# EAGLE design main_board (EAGLE 9.6.2)
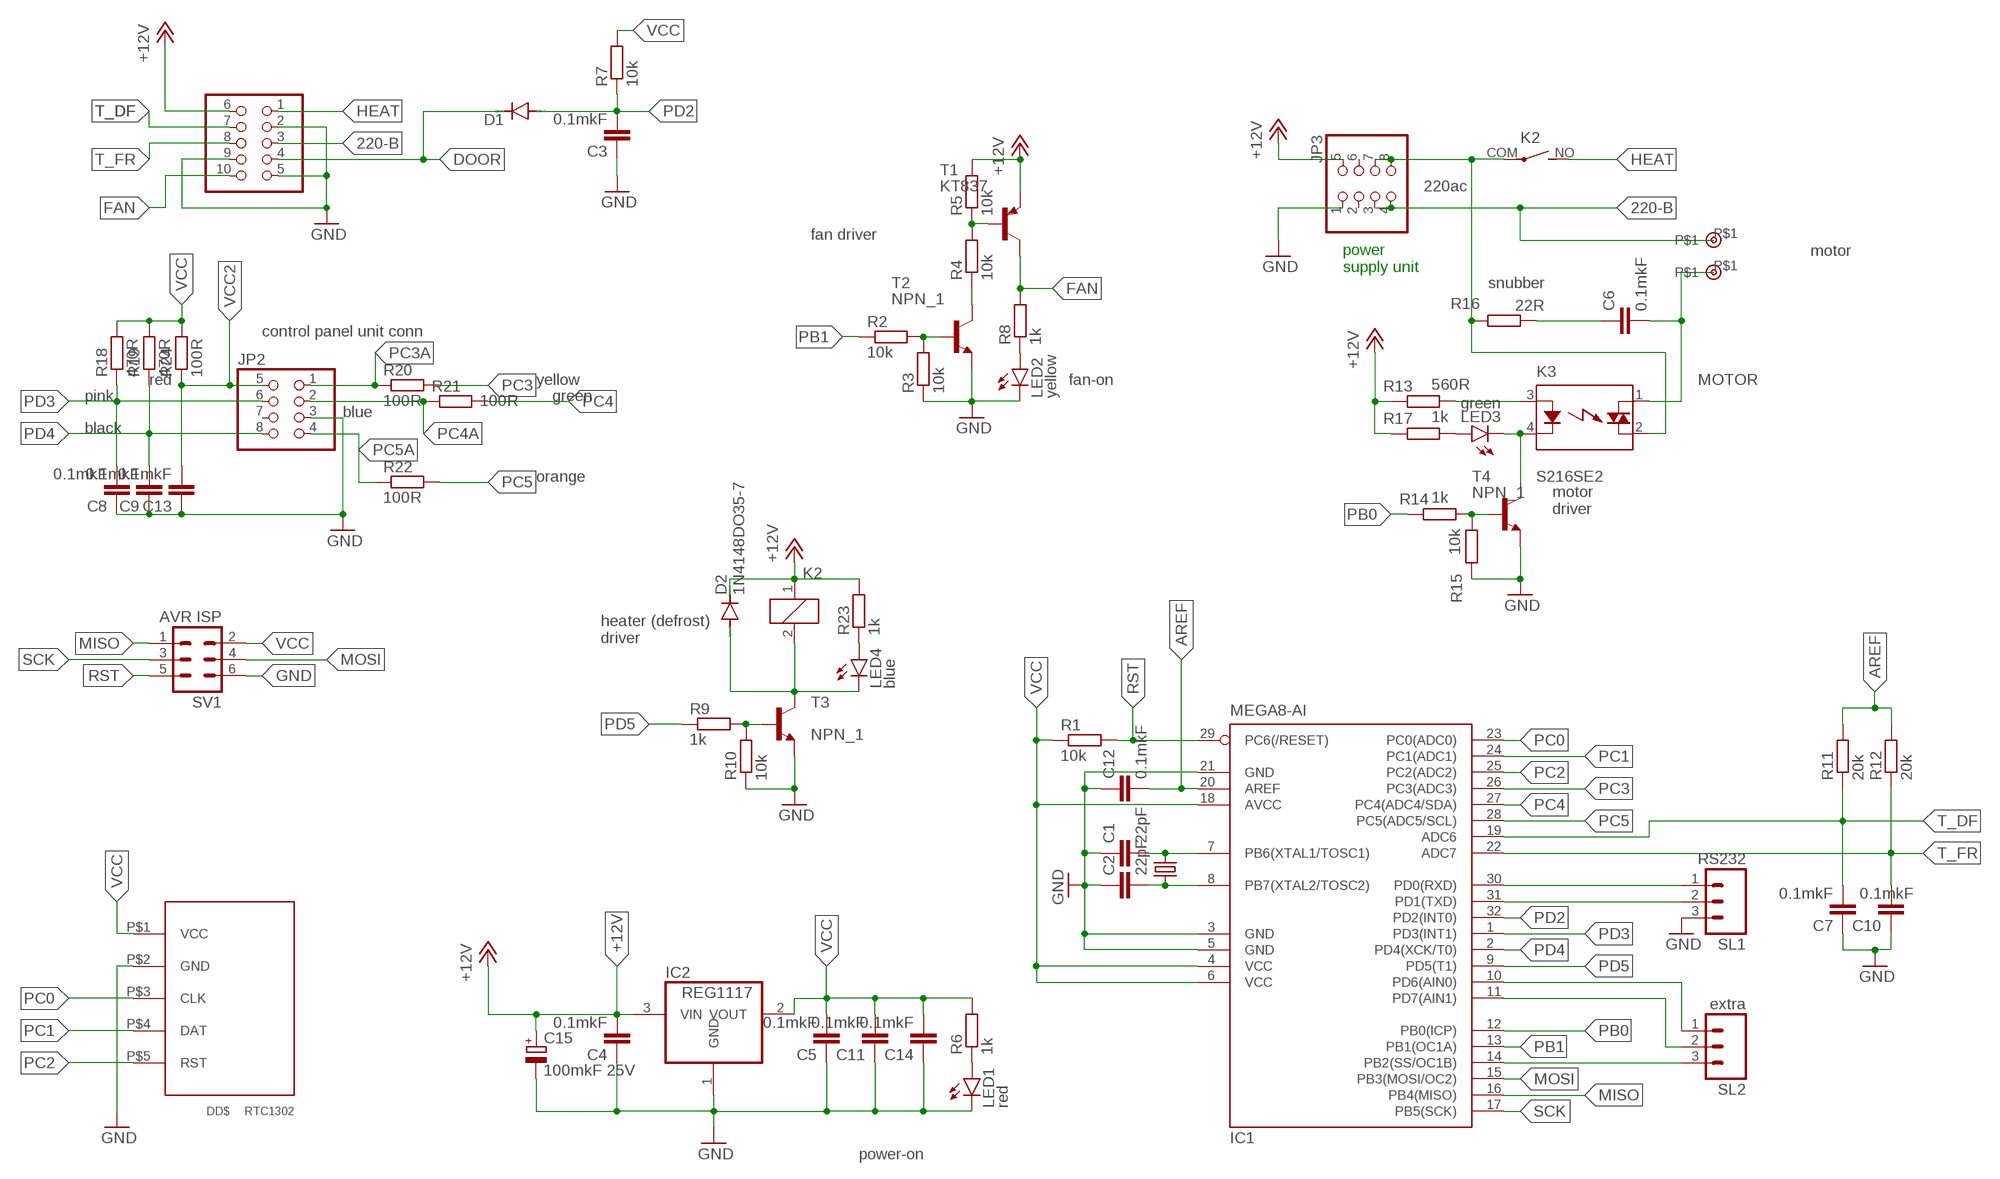
[diagram p0: schematic, sheet 1]

## Parts
C1  22pF  C-EUC0402K  [C0402K]
C2  22pF  C-EUC0402K  [C0402K]
C3  0.1mkF  C-EUC0805K  [C0805K]
C4  0.1mkF  C5/2.5  [C5B2.5]
C5  0.1mkF  C-EUC0805K  [C0805K]
C6  0.1mkF  CAPACITOR_W2P150  [PACK_2PIN_150]
C7  0.1mkF  C-EUC0805K  [C0805K]
C8  0.1mkF  C-EUC0805K  [C0805K]
C9  0.1mkF  C-EUC0805K  [C0805K]
C10  0.1mkF  C-EUC0805K  [C0805K]
C11  0.1mkF  C-EUC0805K  [C0805K]
C12  0.1mkF  C-EUC0805K  [C0805K]
C13  0.1mkF  C-EUC0805K  [C0805K]
C14  0.1mkF  C-EUC0805K  [C0805K]
C15  100mkF 25V  CPOL-EUB45181A  [B45181A]
CN1  CONTACT  [CONTACT]
CN2  CONTACT  [CONTACT]
D1  1N4148DO35-7  [DO35-7]
D2  1N4148DO35-7  [DO35-7]
DD1  RTC-DS1302-MODULEABOVE  [RTC-DS1302-M2]
IC1  MEGA8-AI  [TQFP32-08]
IC2  REG1117  [SOT223]
JP1  CONN_2X5_4.2MMANGLE-0  [CONN_2X05_4.2MM]
JP2  CONN_2X4_4.2MM  [CONN_2X04_4.2MM]
JP3  CONN_2X4_4.2MM  [CONN_2X04_4.2MM]
K2  RELAY_ALK3213  [ALK3213]
K3  S216SE2  [S2XXEX]
LED1  red  LED3MM  [LED3MM]
LED2  yellow  LED3MM  [LED3MM]
LED3  green  LED3MM  [LED3MM]
LED4  blue  LED3MM  [LED3MM]
R1  10k  R-EU_R0805  [R0805]
R2  10k  R-EU_R0805  [R0805]
R3  10k  R-EU_R0805  [R0805]
R4  10k  R-EU_R0805  [R0805]
R5  10k  R-EU_R0805  [R0805]
R6  1k  R-EU_R0805  [R0805]
R7  10k  R-EU_R0805  [R0805]
R8  1k  R-EU_R0805  [R0805]
R9  1k  R-EU_R0805  [R0805]
R10  10k  R-EU_R0805  [R0805]
R11  20k  R-EU_R0805  [R0805]
R12  20k  R-EU_R0805  [R0805]
R13  560R  R-EU_R0805  [R0805]
R14  1k  R-EU_R0805  [R0805]
R15  10k  R-EU_R0805  [R0805]
R16  22R  RESISTOR_W2P150  [PACK_2PIN_150]
R17  1k  R-EU_R0805  [R0805]
R18  470R  R-EU_R0805  [R0805]
R19  470R  R-EU_R0805  [R0805]
R20  100R  R-EU_R0805  [R0805]
R21  100R  R-EU_R0805  [R0805]
R22  100R  R-EU_R0805  [R0805]
R23  1k  R-EU_R0805  [R0805]
R24  100R  R-EU_R0805  [R0805]
SL1  RS232  MA03  [03P]
SL2  extra  MA03  [03P]
SV1  AVR ISP  MA03-2  [MA03-2]
T1  KT837  -PNP-TO220V  [TO220V]
T2  NPN_1  [TO92]
T3  NPN_1  [TO92]
T4  NPN_1  [TO92]
X1  16MHz  CRYSTALS-NOGND-HC49/4H  [HC49]

## Nets
220-A [ac220]: JP3.7 JP3.8 K2.COM(2:P) K3.2(DS2) R16.P$2
220-B [ac220]: CN1.P$1 JP1.3 JP3.3 JP3.4
+12V [suppl]: C4.2 C15.+ D2.C IC2.3(VIN) JP1.6 JP3.5 K2.1 R5.2 R13.1 R17.1 R23.2 T1.3(E)
AREF [suppl]: C12.2 IC1.20(AREF) R11.2 R12.2
DOOR: D1.C JP1.4
FAN [suppl]: JP1.10 R8.2 T1.2(C)
GND: C1.1 C2.1 C3.1 C4.1 C5.1 C7.1 C8.1 C9.1 C10.1 C11.1 C12.1 C13.1 C14.1 C15.- DD1.P$2(GND) IC1.3(GND) IC1.5(GND) IC1.21(GND) IC2.1(GND) JP1.2 JP1.5 JP1.9 JP2.3 JP3.1 LED1.K(C) LED2.K(C) R3.1 R10.1 R15.1 SL1.3 SV1.6 T2.E T3.E T4.E
HEAT [ac220]: JP1.1 K2.NO(2:S)
MISO: IC1.16(PB4(MISO)) SV1.1
MOSI: IC1.15(PB3(MOSI/OC2)) SV1.4
MOTOR [ac220]: C6.P$2 CN2.P$1 K3.1(DS1)
N$1: C6.P$1 R16.P$1
N$2: R9.2 R10.2 T3.B
N$3: R2.2 R3.2 T2.B
N$4: R4.1 T2.C
N$5: R4.2 R5.1 T1.1(B)
N$6: LED1.A R6.1
N$7: IC1.30(PD0(RXD)) SL1.1
N$8: LED2.A R8.1
N$11: IC1.31(PD1(TXD)) SL1.2
N$14: K3.3(A) R13.2
N$15: R14.2 R15.2 T4.B
N$16: K3.4(K) LED3.K(C) T4.C
N$17: LED3.A R17.2
N$20: IC1.10(PD6(AIN0)) SL2.1
N$21: IC1.11(PD7(AIN1)) SL2.2
N$22: IC1.14(PB2(SS/OC1B)) SL2.3
N$24: LED4.A R23.1
N$25: D2.A K2.2 LED4.K(C) T3.C
PB0: IC1.12(PB0(ICP)) R14.1
PB1: IC1.13(PB1(OC1A)) R2.1
PC0: DD1.P$3(CLK) IC1.23(PC0(ADC0))
PC1: DD1.P$4(DAT) IC1.24(PC1(ADC1))
PC2: DD1.P$5(RST) IC1.25(PC2(ADC2))
PC3: IC1.26(PC3(ADC3)) R20.2
PC3A: JP2.1 R20.1
PC4: IC1.27(PC4(ADC4/SDA)) R21.2
PC4A: JP2.2 R21.1
PC5: IC1.28(PC5(ADC5/SCL)) R22.2
PC5A: JP2.4 R22.1
PD2: C3.2 D1.A IC1.32(PD2(INT0)) R7.1
PD3: C8.2 IC1.1(PD3(INT1)) JP2.6 R18.1
PD4: C9.2 IC1.2(PD4(XCK/T0)) JP2.8 R19.1
PD5: IC1.9(PD5(T1)) R9.1
RST: IC1.29(PC6(/RESET)) R1.2 SV1.5
SCK: IC1.17(PB5(SCK)) SV1.3
T_DF: C7.2 IC1.19(ADC6) JP1.7 R11.1
T_FR: C10.2 IC1.22(ADC7) JP1.8 R12.1
VCC [suppl]: C5.2 C11.2 C14.2 DD1.P$1(VCC) IC1.4(VCC) IC1.6(VCC) IC1.18(AVCC) IC2.2(VOUT) R1.1 R6.2 R7.2 R18.2 R19.2 R24.2 SV1.2
VCC2 [suppl]: C13.2 JP2.5 R24.1
XTAL1: C1.2 IC1.7(PB6(XTAL1/TOSC1)) X1.2
XTAL2: C2.2 IC1.8(PB7(XTAL2/TOSC2)) X1.1
Unconnected: JP2.7 JP3.2 JP3.6

## Notes on the sheet
- 220ac
- fan driver
- motor
- power
  supply unit
- snubber
- control panel unit conn
- red | yellow | fan-on
- pink | green
- blue
- black
- orange
- motor
  driver
- heater (defrost)
  driver
- power-on

## Library data of the parts
C1-C3 C5 C7-C14 = rcl:C-EU: CAPACITOR, European symbol; SPICEPREFIX: C
C4 = capacitor-wima:C: CAPACITOR naming: grid - package width
C6 = OU_USSR:CAPACITOR_W
C15 = rcl:CPOL-EU: POLARIZED CAPACITOR, European symbol; SPICEPREFIX: C
CN1 CN2 = OU_USSR:CONTACT
D1 D2 = diode:1N4148: DIODE high speed (Philips)
DD1 = OU_USSR:RTC-DS1302-MODULE
IC1 = atmel:MEGA8: MICROCONTROLLER 8 Kbytes FLASH, 1 kbytes SRAM, 512 bytes EEPROM, USART, 6-channel 10 bit ADC, 2-channel 8 bit ADC Pin compatible with Atmega48, ATMega88, ATMega168 Source: avr.lbr; MPN: ATMEGA8-16AU; OC_FARNELL: 9171371; OC_NEWARK: 73M8863
IC2 = burr-brown:REG1117: 800mA and 1A Low Dropout (LDO) Positive Regulator 1.8V, 2.5V, 2.85V, 3.3V, 5V, and Adj; MPN: REG1117; OC_FARNELL: 1097566; OC_NEWARK: 14P6981
JP1 = OU_USSR:CONN_2X5_4.2MM: (I use it in the refrigirator Wherlpool). Step 4.2 (x 5.5) mm. 22x20mm angle 90 MF-10MRA (N42GK-10) Угловой Ninigi MF-10MA (N42GP-10) Прямой Опис: Крок контактів: 4.2мм; Число контактів: 10 Тип роз’єма: Mini-Fit Монтаж: плата Роз’єм: Вилка К-сть контактів: 10 Крок контактів: 4.2 mm
JP2 JP3 = OU_USSR:CONN_2X4_4.2MM
K2 = OU_USSR:RELAY_ALK3213: Nais ALK3213 250VAC 3A разомкнутые контакты Обмотка: 12В, 285 Ом; OC_FARNELL: unknown
K3 = OU_USSR:S216SE2
LED1-LED4 = OU_USSR:LED: LED OSRAM: - CHIPLED LG R971, LG N971, LY N971, LG Q971, LY Q971, LO R971, LY R971 LH N974, LH R974 LS Q976, LO Q976, LY Q976 LO Q996 - Hyper CHIPLED LW Q18S LB Q993, LB Q99A, LB R99A - SideLED LS A670, LO A670, LY A670, LG A670, LP A670 LB A673, LV A673, LT A673, LW A673 LH A674 LY A675 LS A676, LA A676, LO A676, LY A676, LW A676 LS A679, LY A679, LG A679 - Hyper Micro SIDELED® LS Y876, LA Y876, LO Y876, LY Y876 LT Y87S - SmartLED LW L88C, LW L88S LB L89C, LB L89S, LG L890 LS L89K, LO L89K, LY L89K LS L896, LA L896, LO L896, LY L896 - TOPLED LS T670, LO T670, LY T670, LG T670, LP T670 LSG T670, LSP T670, LSY T670, LOP T670, LYG T670 LG T671, LOG T671, LSG T671 LB T673, LV T673, LT T673, LW T673 LH T674 LS T676, LA T676, LO T676, LY T676, LB T676, LH T676, LSB T676, LW T676 LB T67C, LV T67C, LT T67C, LS T67K, LO T67K, LY T67K, LW E67C LS E67B, LA E67B, LO E67B, LY E67B, LB E67C, LV E67C, LT E67C LW T67C LS T679, LY T679, LG T679 LS T770, LO T770, LY T770, LG T770, LP T770 LB T773, LV T773, LT T773, LW T773 LH T774 LS E675, LA E675, LY E675, LS T675 LS T776, LA T776, LO T776, LY T776, LB T776 LHGB T686 LT T68C, LB T68C - Hyper Mini TOPLED® LB M676 - Mini TOPLED Santana® LG M470 LS M47K, LO M47K, LY M47K Source: http://www.osram.convergy.de LUXEON: - LUMILED® LXK2-PW12-R00, LXK2-PW12-S00, LXK2-PW14-U00, LXK2-PW14-V00 LXK2-PM12-R00, LXK2-PM12-S00, LXK2-PM14-U00 LXK2-PE12-Q00, LXK2-PE12-R00, LXK2-PE12-S00, LXK2-PE14-T00, LXK2-PE14-U00 LXK2-PB12-K00, LXK2-PB12-L00, LXK2-PB12-M00, LXK2-PB14-N00, LXK2-PB14-P00, LXK2-PB14-Q00 LXK2-PR12-L00, LXK2-PR12-M00, LXK2-PR14-Q00, LXK2-PR14-R00 LXK2-PD12-Q00, LXK2-PD12-R00, LXK2-PD12-S00 LXK2-PH12-R00, LXK2-PH12-S00 LXK2-PL12-P00, LXK2-PL12-Q00, LXK2-PL12-R00 Source: www.luxeon.com KINGBRIGHT: KA-3528ASYC Source: www.kingbright.com
R1-R15 R17-R24 = rcl:R-EU_: RESISTOR, European symbol; SPICEPREFIX: R
R16 = OU_USSR:RESISTOR_W
SL1 SL2 = con-amp-quick:MA03: AMP QUICK CONNECTOR; OC_FARNELL: unknown; OC_NEWARK: unknown
SV1 = con-lstb:MA03-2: PIN HEADER; OC_FARNELL: unknown; OC_NEWARK: unknown
T1 = transistor:*-PNP-: PNP Transistror
T2-T4 = OU_USSR:NPN_1
X1 = IQD-Frequency-Products:CRYSTALS-NOGND: CRYSTALS CAN NOT GROUNDED

## Net classes
0 default: width 0.356 mm, drill 0.6 mm
1 ac220: width 1.016 mm, drill 1 mm
2 suppl: width 0.762 mm, drill 1 mm
3 gnd: width 0.762 mm, drill 1 mm

## Board
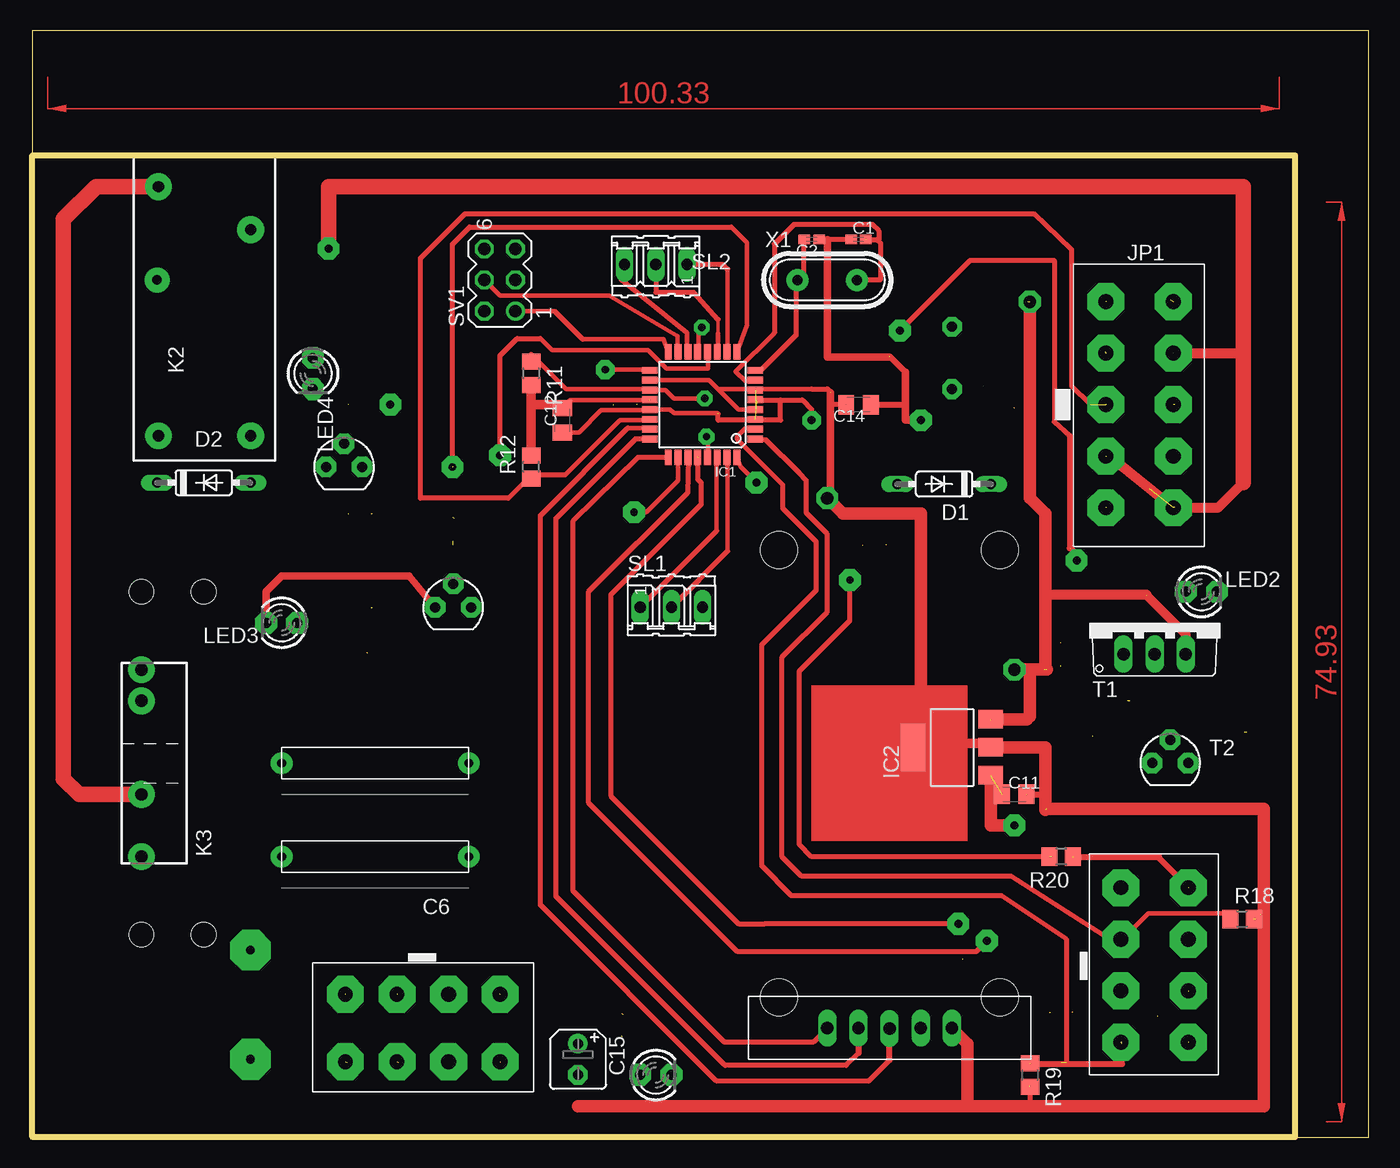
[diagram p1: board, top side]
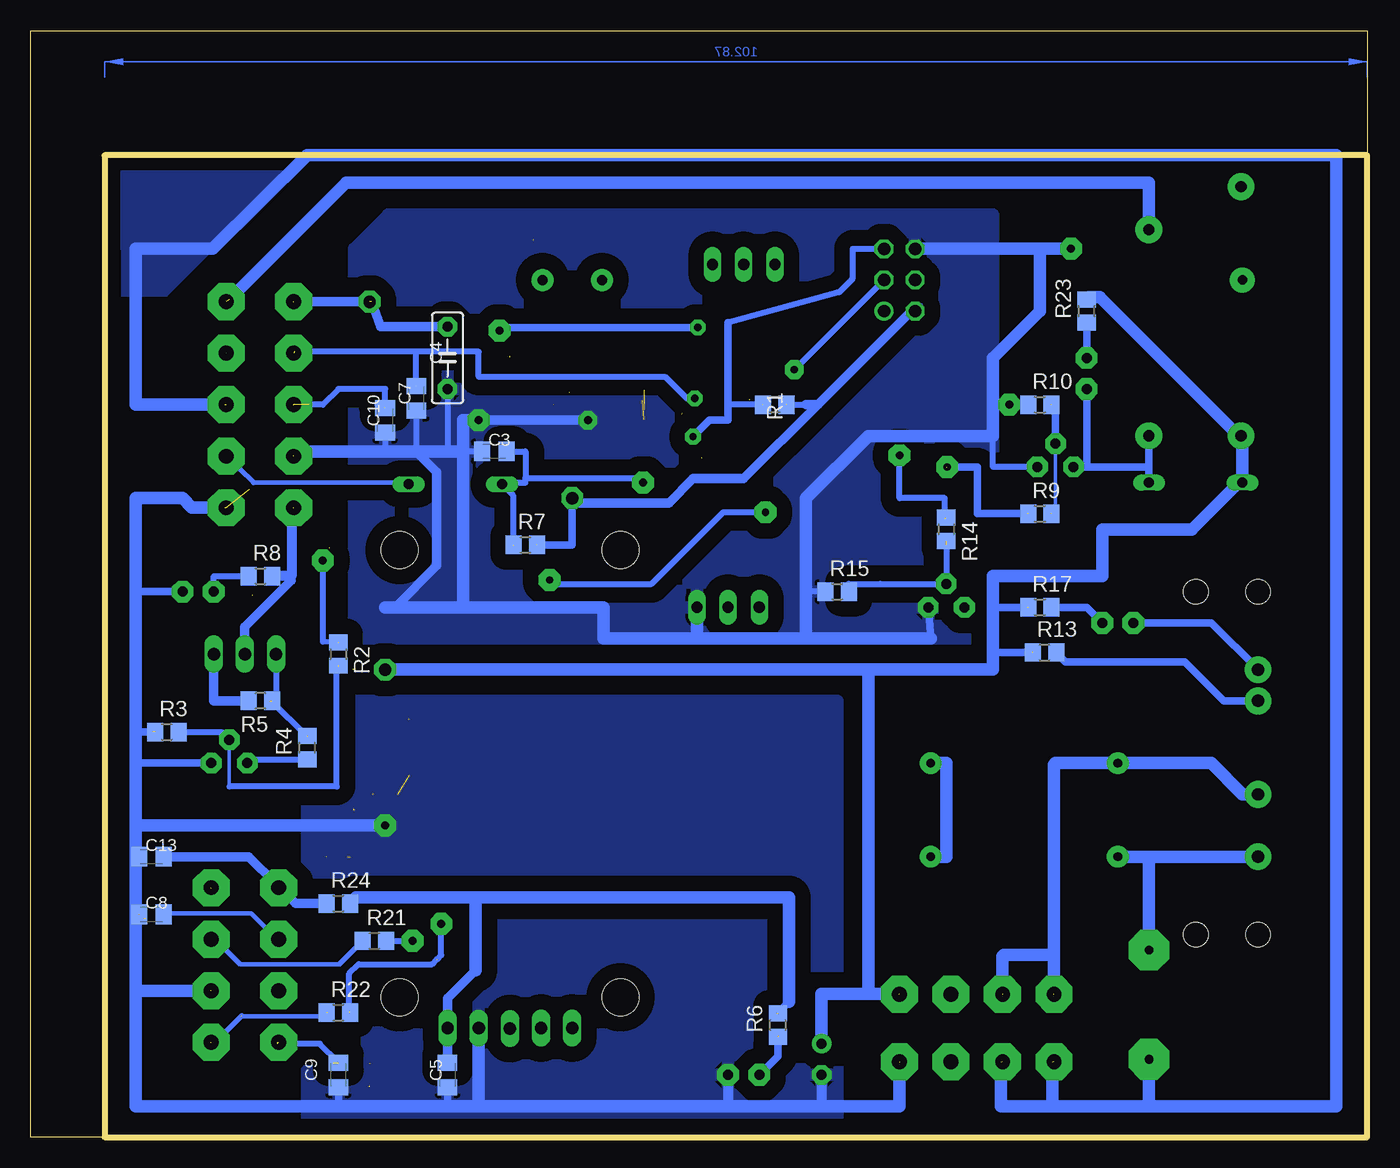
[diagram p2: board, bottom side, seen from below]

Size 108.89 x 90.16 mm. Coordinates in mm from the lower left corner, seen from the top.
Outline: 0,0 108.89,0 108.89,90.16 0,90.16 0,0
Outline: 0,0 0,80.01 102.87,80.01 102.87,0 0,0
Copper layers (1*16): Top 0.035mm / dielectric 1.5mm / Bottom 0.035mm
Design rules "default": minimum track width 6mil, minimum drill 0.35mm, track to track 6mil, track to pad 6mil, pad to pad 6mil, via to via 6mil, smd to smd 6mil, copper to edge 40mil, drill to drill 6mil, minimum pad ring 10mil, minimum via ring 8mil, stop-mask expansion 4mil, vias tented up to drill 0mil, thermal gap 10mil
Holes 2 mm at 13.97,44.45 13.97,16.51 8.89,16.51 8.89,44.45

### Footprints (pad centres in the part's own frame; a part is rotated, then mirrored left to right if it is on the bottom)
C0402K = smd 0.925 x 0.74: 1 -0.6,0; 2 0.6,0
C0805K = smd 1.3 x 1.6: 1 -1,0; 2 1,0
C5B2.5 = drill 0.813 pad 1.6 octagon: 1 -2.54,0; 2 2.54,0
PACK_2PIN_150 = drill 0.7 pad 1.778: P$1 -7.62,0; P$2 7.62,0
B45181A = drill 0.813 pad 1.6: + -1.27,0 | drill 0.813 pad 1.6 octagon: - 1.27,0
CONTACT = drill 0.7 pad 3.302 octagon: P$1 0,0
DO35-7 = drill 0.813 long: A 3.81,0; C -3.81,0
RTC-DS1302-M2 = drill 1 long: P$1 2.54,-5.08; P$2 2.54,-2.54; P$3 2.5,0; P$4 2.54,2.54; P$5 2.54,5.08 | drill 0.7 pad 1.778: P$6 4.953,9.017; P$7 41.529,9.017; P$8 41.529,-9.017; P$9 5.08,-8.89 | hole 3: 5.04,9; 5.04,-9; 41.5,9; 41.5,-9
TQFP32-08 = smd 1.27 x 0.559: 1 -4.293,2.8; 2 -4.293,2; 3 -4.293,1.2; 4 -4.293,0.4; 5 -4.293,-0.4; 6 -4.293,-1.2; 7 -4.293,-2; 8 -4.293,-2.8; 17 4.293,-2.8; 18 4.293,-2; 19 4.293,-1.2; 20 4.293,-0.4; 21 4.293,0.4; 22 4.293,1.2; 23 4.293,2; 24 4.293,2.8 | smd 0.559 x 1.27: 9 -2.8,-4.293; 10 -2,-4.293; 11 -1.2,-4.293; 12 -0.4,-4.293; 13 0.4,-4.293; 14 1.2,-4.293; 15 2,-4.293; 16 2.8,-4.293; 25 2.8,4.293; 26 2,4.293; 27 1.2,4.293; 28 0.4,4.293; 29 -0.4,4.293; 30 -1.2,4.293; 31 -2,4.293; 32 -2.8,4.293
SOT223 = smd 1.499 x 2.007: 1 -2.261,-3.15; 2 0.025,-3.15; 3 2.311,-3.15 | smd 3.81 x 2.007: 4 0,3.15
CONN_2X05_4.2MM = drill 1.2 pad 3 octagon: 1 -8.4,2.794; 2 -4.2,2.794; 3 0,2.794; 4 4.2,2.794; 5 8.4,2.794; 6 -8.4,-2.706; 7 -4.2,-2.706; 8 0,-2.706; 9 4.2,-2.706; 10 8.4,-2.706
CONN_2X04_4.2MM = drill 1.2 pad 3 octagon: 1 -6.36,2.74; 2 -2.16,2.74; 3 2.04,2.74; 4 6.24,2.74; 5 -6.36,-2.76; 6 -2.16,-2.76; 7 2.04,-2.76; 8 6.24,-2.76
ALK3213 = drill 0.9 pad 2.184: 1 0,7.5; 2 0,0; COM 20.3,7.5; NO 16.8,0
S2XXEX = drill 1 pad 2.184: 1 -7.62,0; 2 -2.54,0; 3 5.08,0; 4 7.62,0
LED3MM = drill 0.813 pad 1.778 octagon: A -1.27,0; K 1.27,0
R0805 = smd 1.3 x 1.5: 1 -0.95,0; 2 0.95,0
03P = drill 0.914 long: 1 -2.54,0; 2 0,0; 3 2.54,0
MA03-2 = drill 1.016: 1 -2.54,-1.27 | drill 1.016 octagon: 2 -2.54,1.27; 3 0,-1.27; 4 0,1.27; 5 2.54,-1.27; 6 2.54,1.27
TO220V = drill 1.016 long: 1 -2.54,-2.54; 2 0,-2.54; 3 2.54,-2.54
TO92 = drill 0.813 pad 1.676 octagon: B 0,1.905; C -1.473,0; E 1.473,0
HC49 = drill 0.813 pad 1.8: 1 -2.413,0; 2 2.413,0

### Placement (x,y rotation side)
C1  67.31,73.15 0 top
C2  63.5,73.15 180 top
C3  71.12,55.88 0 bottom
C4  74.93,63.5 90 bottom
C5  74.93,5.08 90 bottom
C6  27.94,22.86 180 top
C7  77.47,60.2 90 bottom
C8  99.06,18.16 0 bottom
C9  83.82,5.08 90 bottom
C10  80.01,58.42 90 bottom
C11  80.01,27.94 0 top
C12  43.18,58.42 90 top
C13  99.06,22.86 0 bottom
C14  67.31,59.69 180 top
C15  44.45,6.35 270 top
CN1  17.78,6.35 0 top
CN2  17.78,15.24 0 top
D1  74.3,53.21 180 top
D2  13.97,53.34 0 top
DD1  69.85,6.35 90 top
IC1  54.61,59.69 180 top
IC2  74.93,31.75 90 top
JP1  90.17,59.69 270 top
JP2  91.44,13.97 270 top
JP3  31.75,8.89 180 top
K2  17.78,57.15 90 top
K3  8.89,30.48 90 top
LED1  50.8,5.08 0 top
LED2  95.25,44.45 0 top
LED3  20.32,41.91 180 top
LED4  22.86,62.23 270 top
R1  48.26,59.69 180 bottom
R2  83.82,39.37 270 bottom
R3  97.79,33.02 0 bottom
R4  86.36,31.75 90 bottom
R5  90.17,35.56 180 bottom
R6  48.01,9.14 90 bottom
R7  68.58,48.26 0 bottom
R8  90.17,45.72 0 bottom
R9  26.67,50.8 0 bottom
R10  26.67,59.69 0 bottom
R11  40.64,62.23 270 top
R12  40.64,54.61 90 top
R13  26.29,39.5 0 bottom
R14  34.29,49.53 270 bottom
R15  43.18,44.45 0 bottom
R16  27.94,30.48 180 top
R17  26.67,43.18 0 bottom
R18  98.55,17.78 0 top
R19  81.28,5.08 270 top
R20  83.82,22.86 180 top
R21  80.9,16 0 bottom
R22  83.82,10.16 0 bottom
R23  22.86,67.31 90 bottom
R24  83.82,19.05 0 bottom
SL1  52.07,43.18 0 top
SL2  50.8,71.12 180 top
SV1  38.1,69.85 90 top
T1  91.44,41.91 0 top
T2  92.71,30.48 0 top
T3  25.4,54.61 0 top
T4  34.29,43.18 0 top
X1  64.77,69.85 0 top

### Tracks (layer width: path | path; a pad name or v marks a point on that pad's centre or on a via)
220-A  (2 unrouted)
  Top 1.27: K3.2 3.81,27.94 2.54,29.21 2.54,74.79 5.2,77.45 K2.COM
  Bottom 1.016: 25.53,14.86 25.53,30.35 25.4,30.48 R16.P$2 12.7,30.48 10.16,27.94 K3.2 | 25.53,11.68 25.53,13.97 25.53,14.86 | 29.72,11.68 29.72,14.73 29.59,14.86 25.53,14.86
220-B  (3 unrouted)
  Bottom 1.016: 29.84,6.1 29.84,2.54 25.65,2.54 | 25.65,2.54 17.78,2.54 | 17.78,2.54 2.54,2.54 2.54,80.01 86.36,80.01 94.06,72.39 100.33,72.39 100.33,59.69 93.09,59.69 | 25.65,6.1 25.65,2.54 | CN1.P$1 17.78,2.54
  pour Bottom: 86.36,80.01 86.36,82.55 102.87,82.55 102.87,72.39 93.98,72.39
  pour Bottom: 104.14,72.39 93.98,72.39 86.36,80.01 86.36,81.28 104.14,81.28
  pour Bottom: 101.6,72.39 101.6,68.58 97.79,68.58 93.98,72.39
+12V  (via drill 1 pad 1.78)  (8 unrouted)
  Top 0.762: 93.98,39.05 T1.3 93.98,40.96 90.8,44.13 | 77.79,33.97 IC2.3
  Top 0.813: 90.8,44.2 82.55,44.2
  Top 1.016: v80.01,38.1 81.28,38.1 | 81.28,38.1 81.28,34.29 81.03,34.04 78.1,34.04 | v81.28,68.07 81.28,52.07 82.55,50.8 82.55,44.2 82.55,38.1 82.68,38.1 | 82.42,38.1 81.28,38.1
  Bottom 0.61: 27.69,43.18 30.48,43.18 | 27.3,39.5 30.48,39.5
  Bottom 0.762: C4.2 80.38,66.04 81.13,68.09 | T1.3 93.98,35.56 R5.2 | R13.1 | R17.1 27.62,43.5 | 10.48,57.15 K2.1 10.16,56.83 | 10.48,53.34 D2.C | v81.28,68.07 87.5,68.07
  Bottom 1.016: R23.2 22.67,68.45 21.78,68.45 10.48,57.15 | 10.16,56.83 D2.C | 10.48,53.34 14.29,49.53 21.59,49.53 21.59,45.72 30.48,45.72 30.48,43.18 30.48,39.5 30.48,38.1 40.64,38.1 | C15.+ 44.45,11.68 40.89,11.68 | 40.89,11.68 38.1,11.68 | v80.01,38.1 40.64,38.1 | 40.89,11.68 40.64,11.94 40.64,38.1
AREF  (1 unrouted)
  Top 0.356: 50.29,60.07 43.82,60.07 43.18,59.44
  Top 0.762: R11.2 40.64,59.69 | 40.64,59.69 R12.2 | 40.64,59.69 43.18,59.69 43.18,59.44 C12.2
DOOR
  Bottom 0.356: 90.73,53.34 78.1,53.34 D1.C | 90.73,53.34
  Bottom 0.406: 90.73,53.34 JP1.4
FAN  (1 unrouted)
  Bottom 0.762: 88.01,45.72 87.66,45.37 91.44,41.59 T1.2 | 89.41,45.72 R8.2
  Bottom 0.813: 87.5,51.31 87.63,51.18 87.63,45.72 88.01,45.72 89.41,45.72
GND  (via drill 0.65 pad 1.52, 0.65 pad 1.78)  (14 unrouted)
  Top 0.356: C12.1 44.53,57.42 46.36,59.25 50.27,59.25 IC1.21 51.97,59.29 52.27,58.99 55.82,58.99 | 78.1,29.53 IC2.1 | 64.77,73.15 C2.1 | 59.05,60.01 IC1.5 58.74,60.01 | 87.63,55.63 87.5,55.5 88.01,55.5 89.79,53.72 90.17,53.72 91.06,52.83
  Top 0.406: C1.1 64.77,73.15 | 58.93,60.07 60.96,60.07 | C14.1 68.64,59.69 | 55.88,58.93 55.88,58.42 60.96,58.42 60.96,60.07 | 60.96,60.07 62.74,60.07 63.5,59.31 v63.5,58.42 | 78.1,29.46 78.74,28.83 78.74,27.94
  Top 0.508: 68.64,59.69 71.12,59.69 | 71.12,62.36 69.85,63.63 | 78.74,27.94 78.1,28.57 78.1,29.46 | 78.23,25.4 78.23,27.18 78.99,27.94
  Top 0.61: 64.77,73.15 64.77,63.56 69.85,63.56 | v72.39,58.42 71.12,58.42 71.12,59.69 71.12,62.36
  Top 0.813: 98.68,53.34 96.65,51.31 92.96,51.31 87.63,55.63 | JP1.2 98.68,63.88
  Top 1.016: 78.1,29.46 78.1,25.4 78.23,25.4 v80.01,25.4
  Top 1.27: 98.68,53.34 98.68,63.88 98.68,77.47 24.13,77.47 v24.13,72.39
  Bottom 0.356: 72.39,55.88 C3.1 72.07,55.88 | 34.93,57.47 40.32,57.47 40.64,57.15 | 74.93,4.13 C5.1 74.93,3.81 | 83.82,4.13 C9.1 | 98.42,33.02 R3.1 | C13.1 100.01,22.86 100.01,18.16 C8.1 | 100.33,18.16 100.08,18.16
  Bottom 0.406: C7.1 77.47,57.6 | R10.1 v29.17,59.69
  Bottom 0.508: 44.2,44.45 45.72,44.45 | 27.69,59.69 v29.17,59.69 30.48,59.69 | T3.E 30.48,54.61 30.48,57.15 | 80.01,57.4 80.01,55.88 | 77.47,59.18 77.47,57.6 77.47,55.88 | 72.39,55.88 73.66,55.88 | C4.1 74.93,55.88
  Bottom 0.61: LED2.K 100.33,44.45 | T2.E 100.33,30.48 | 98.93,33.02 100.33,33.02 | 83.82,2.54 83.82,3.81 | 74.93,3.81 74.93,2.54 | T4.E 35.56,40.64
  Bottom 0.762: v63.5,58.42 v72.39,58.42 | 83.82,3.81 83.82,4.13 | 77.47,55.88 75.8,54.21 75.8,46.59 79.21,43.18 80.01,43.18
  Bottom 0.813: C15.- 44.45,2.54 | LED1.K 52.07,2.54
  Bottom 1.016: 38.1,6.1 38.1,2.54 44.45,2.54 52.07,2.54 72.39,2.54 | 72.39,2.54 74.93,2.54 83.82,2.54 100.33,2.54 100.33,11.94 | 100.33,11.94 100.33,18.16 100.33,25.4 | 100.33,25.4 100.33,30.48 100.33,33.02 100.33,44.45 100.33,52.07 96.52,52.07 95.76,51.31 93.09,51.31 | 94.23,11.94 100.33,11.94 | DD1.P$2 72.39,2.54 | SV1.6 26.67,72.39 | 73.66,43.18 62.23,43.18 62.23,40.64 54.61,40.64 | 73.66,43.18 80.01,43.18 | 26.67,72.39 26.67,67.31 30.48,63.5 30.48,59.69 30.48,57.15 40.64,57.15 45.72,52.07 45.72,44.45 45.72,40.64 | 45.72,40.64 54.61,40.64 | SL1.3 54.61,40.64 | 45.72,40.64 35.56,40.64 | 87.5,55.5 87.12,55.88 80.01,55.88 77.47,55.88 74.93,55.88 73.66,55.88 | 73.66,55.88 73.66,43.18 | v72.39,58.42 73.66,58.42 73.66,55.88 | v80.01,25.4 100.33,25.4 | v24.13,72.39 26.67,72.39 | 26.67,72.39 26.8,72.26
  pour Bottom (isolate 1.27, rank 3): 79.76,75.18 30.48,75.18 30.48,40.64 82.55,40.64 82.55,72.39
  pour Bottom (isolate 1.27): 43.18,35.56 86.36,35.56 86.36,-1.27 43.18,-1.27
HEAT  (1 unrouted)
  Bottom 1.016: 92.71,68.26 83.19,77.79 17.78,77.79 K2.NO
MISO
  Top 0.356: 44.83,65.02 51.42,65.02 IC1.16 | SV1.1 42.55,67.31
  Top 0.406: 44.83,65.02 42.55,67.31
MOSI
  Top 0.356: IC1.15 52.58,64.02 52.58,65.28 46.99,68.58 38.1,68.58 SV1.4
MOTOR
  Bottom 1.016: C6.P$2 17.78,22.86 | 17.78,22.86 K3.1 | CN2.P$1 17.78,22.86
N$1
  Bottom 1.016: R16.P$1 34.29,30.48 34.29,22.86 C6.P$1
N$2  (2 unrouted)
  Bottom 0.305: T3.B 25.4,51.18
  Bottom 0.61: 25.78,59.69 25.4,59.31 T3.B | 25.4,51.18 25.78,50.8
N$3  (1 unrouted)
  Bottom 0.305: T2.B 92.71,28.57
  Bottom 0.356: R3.2
  Bottom 0.508: 92.71,28.57 83.95,28.57 83.95,38.23 83.82,38.35 | T2.B 93.34,33.02 R3.2
N$4
  Bottom 0.356: T2.C 91.12,30.8 | R4.1
  Bottom 0.508: 91.12,30.8 R4.1
N$5  (3 unrouted)
  Bottom 0.356: R4.2
  Bottom 0.508: T1.1 88.9,36.07 89.41,35.56 | 89.28,35.56 86.36,32.64
N$6  (1 unrouted)
  Bottom 0.61: 48.01,8.26 48.01,6.6 LED1.A
N$7
  Top 0.356: IC1.30 55.75,55.34 55.75,49.4
  Top 0.406: SL1.1 55.75,49.4
N$8
  Bottom 0.508: R8.1 93.98,45.72 LED2.A
N$9
  Top 0.406: 86.23,59.69 87.5,59.69
N$11
  Top 0.356: IC1.31 56.64,55.37 56.64,47.75
  Top 0.406: SL1.2 56.64,47.75
N$14
  Bottom 0.61: R13.2 24.58,38.74 14.86,38.74 11.68,35.56 K3.3
N$15  (1 unrouted)
  Bottom 0.356: R15.2 42.23,45.09
  Bottom 0.406: T4.B 34.42,44.96
  Bottom 0.508: 42.23,45.09 39.69,45.09 T4.B 34.29,48.26
N$16
  Top 0.61: T4.C 30.68,45.72 20.32,45.72 19.05,44.45 LED3.K
  Bottom 0.61: K3.4 12.7,41.91 LED3.K
N$17
  Bottom 0.61: R17.2 22.86,43.18 LED3.A
N$18  (via drill 0.8 pad 2.03)
  other vias: 8.89,16.51
N$19  (via drill 0.8 pad 2.03)
  other vias: 8.89,44.45
N$20
  Top 0.356: 56.64,70.74 56.64,64.02 IC1.10
  Top 0.406: SL2.1 56.26,71.12 56.64,70.74
N$21
  Top 0.305: 55.88,66.63 55.88,65.53
  Top 0.356: 55.88,65.53 55.88,64.14 IC1.11
  Top 0.406: SL2.2 50.8,68.83 53.9,68.83 55.88,66.63
N$22
  Top 0.356: 53.34,65.53 53.34,64.14 IC1.14
  Top 0.406: SL2.3 48.01,69.85 53.34,65.53
N$23  (via drill 0.8 pad 2.03)
  other vias: 10.16,69.85
N$24
  Bottom 0.61: LED4.A R23.1
N$25
  Bottom 0.61: K2.2 17.78,54.61 | 17.78,54.61 D2.A | 17.78,54.61 22.86,54.61 | 22.86,54.61 T3.C | 22.86,54.61 LED4.K
PB0  (via drill 0.6 pad 1.78)  (1 unrouted)
  Top 0.356: IC1.12 55.05,63.94 55.05,62.61 51.69,62.61 50.17,64.14 42.35,64.14 41.4,65.09
  Top 0.406: 41.4,65.09 39.5,65.09 38.1,63.69 v38.1,55.56
  Bottom 0.508: v38.1,55.56 38.1,52.07 34.42,52.07 34.42,50.42
PB1  (via drill 0.6 pad 1.27, 0.65 pad 1.78)  (2 unrouted)
  Top 0.356: v54.55,65.98 54.29,65.72 54.29,64.14 IC1.13
  Top 0.406: v70.68,65.72 76.39,71.44 83.26,71.44 83.26,58.29 84.52,57.16 | 85.09,47.5 v85.09,46.99
  Top 0.508: 84.52,57.16 84.52,48.01 | 84.58,48.01 85.09,47.5
  Bottom 0.356: v70.68,65.72 70.42,65.98
  Bottom 0.406: 85.09,40.39 83.95,40.39 83.82,40.26
  Bottom 0.508: v85.09,46.99 85.09,40.39
  Bottom 0.61: 70.42,65.98 v54.55,65.98
PC0
  Top 0.356: 48.51,57.79 50.17,57.79 IC1.23
  Top 0.406: 48.51,57.79 41.4,50.67 41.4,18.92 55.75,4.57 68.13,4.57 69.85,6.29
  Top 0.508: 69.85,6.29 DD1.P$3
PC1
  Top 0.406: IC1.24 49.14,56.89 42.67,50.42 42.67,19.62 56.45,5.84 66.29,5.84 67.31,6.86
  Top 0.508: DD1.P$4 67.31,6.86
PC2
  Top 0.406: IC1.25 49.34,55.4 44.07,50.21 44.07,20.07 56.39,7.75 63.63,7.75 DD1.P$5
PC3  (via drill 0.6 pad 1.78)  (1 unrouted)
  Top 0.356: IC1.26 52.61,53.49 50.05,50.93 v49.02,50.93
  Top 0.406: v66.61,45.4 66.61,42.1 62.48,37.97 62.48,23.88 63.5,22.86 83.06,22.86
  Bottom 0.356: v66.61,45.4 66.29,45.09
  Bottom 0.508: 66.29,45.09 58.29,45.09 52.45,50.93 v49.02,50.93
PC3A  (2 unrouted)
  Top 0.508: 84.84,22.86 91.82,22.86 91.82,22.73 94.23,20.32
PC4  (via drill 0.65 pad 1.78)
  Top 0.406: IC1.27 53.47,55.34 53.39,52.5 45.34,44.45 45.34,27.24 57.47,15.11 76.9,15.11 v77.79,16
  Bottom 0.508: R21.2 v77.79,16
PC4A
  Bottom 0.356: 91.82,14.1 83.75,14.1
  Bottom 0.406: 83.75,14.1 R21.1 | JP2.2 93.85,16.13 91.82,14.1
PC5  (via drill 0.65 pad 1.78)  (3 unrouted)
  Top 0.406: v75.44,17.4 59.69,17.4 57.53,17.4 47.12,27.81 47.12,44.2 54.48,51.56 54.48,53.34 54.23,53.59 54.23,55.37
  Bottom 0.508: 75.79,14.51 75.44,14.86 v75.44,17.4 | 82.93,10.16 82.93,13.33 82.17,14.1 76.2,14.1 75.82,14.48
PC5A  (3 unrouted)
  Bottom 0.356: 84.71,10.16 85.03,9.84 91.69,9.84
  Bottom 0.406: 91.69,9.91 93.85,7.75 94.23,7.75
PD2  (via drill 0.65 pad 1.78)  (1 unrouted)
  Top 0.356: v58.99,53.34 57.7,54.63 IC1.32
  Bottom 0.356: 70.61,53.34 D1.A | 69.85,55.88 70.1,55.88 C3.2
  Bottom 0.406: 59.37,53.72 v58.99,53.34
  Bottom 0.508: 70.61,53.34 68.58,53.34 68.58,53.72 | 68.58,53.72 59.37,53.72 | 69.6,48.26 69.6,52.32 D1.A | 70.1,55.88 68.58,55.88 68.58,53.72
PD3
  Top 0.356: 59.75,56.83 59.05,56.83 IC1.1 | 87.78,16.13 JP2.6 88.9,16.19 90.93,18.22 97.6,18.22 R18.1
  Top 0.406: 59.75,56.83 62.48,54.1 63.05,53.52 63.05,50.86 64.77,49.15 64.77,42.8 61.09,39.12 61.09,22.86 62.67,21.27 79.75,21.27 87.78,16.13
  Bottom 0.356: C8.2 97.79,18.16 97.79,18.22 90.93,18.22 88.9,16.19 JP2.6
PD4  (4 unrouted)
  Top 0.356: 61.15,53.15 57.4,56.9 57.4,57.09 58.1,57.79 58.74,57.79 IC1.2
  Top 0.406: 61.15,53.15 61.15,51.24 63.88,48.51 63.88,44.58 59.44,40.13 59.44,22.1 61.85,19.68 78.98,19.68 84.23,16.15 84.23,6.08
  Top 0.508: 81.28,5.97 88.77,5.97 88.77,7.75
  Bottom 0.356: 83.82,6.1 C9.2
  Bottom 0.508: 83.82,6.1 85.34,7.62 88.77,7.62
PD5  (via drill 0.6 pad 1.78)  (2 unrouted)
  Top 0.356: 56.96,74.17 58.23,72.9 58.23,66.16 IC1.9
  Top 0.406: 56.96,74.17 35.62,74.17 34.23,72.77 v34.23,54.61
  Bottom 0.61: 27.69,50.8 31.75,50.8 31.75,54.61 34.29,54.61
RST  (via drill 0.6 pad 1.27)  (1 unrouted)
  Top 0.356: IC1.29 55.05,55.44 55.05,56.96 v54.93,57.09
  Bottom 0.356: 54.8,57.09 v54.93,57.09
  Bottom 0.508: 52.07,66.39 43.18,68.83 43.05,68.83 42.04,69.85 41.91,69.98 41.91,72.39 SV1.5 | 49.28,59.69 52.07,59.69
  Bottom 0.61: v54.93,57.09 53.59,58.42 52.07,58.42 52.07,59.69 52.07,66.39
SCK  (via drill 0.6 pad 1.52)
  Top 0.356: v46.67,62.55 50.17,62.55 IC1.17
  Bottom 0.508: SV1.3 v46.67,62.55
T_DF  (via drill 0.6 pad 1.27)  (2 unrouted)
  Top 0.356: R11.1 40.64,63.82 43.5,60.96 50.17,60.96 IC1.19 51.59,60.89 52.28,60.2 v54.8,60.2
  Bottom 0.356: 55.44,60.2 v54.8,60.2
  Bottom 0.508: 55.44,60.2 57.21,61.98 72.39,61.98 72.39,64.01 77.47,64.01 | 77.47,64.01 87.39,64.01 | 77.47,61.21 77.47,64.01
T_FR  (3 unrouted)
  Top 0.356: 43.43,53.98 47.88,58.42 50.17,58.42 IC1.22 | 38.8,52.07 40.39,53.66 R12.1 40.64,53.98
  Top 0.406: 40.64,53.98 43.43,53.98 | 86.19,59.69 84.67,61.21 84.67,72.33 81.6,75.25 35.24,75.25 31.62,71.63 31.62,52.07 38.8,52.07
  Bottom 0.508: 80.65,59.69 C10.2 | 80.01,59.44 80.01,60.96 83.82,60.96 85.09,59.69 87.5,59.69
VCC  (via drill 1 pad 1.78)  (10 unrouted)
  Top 0.356: 99.69,17.78 100.33,17.78 | 63.5,60.96 55.88,60.96 | IC1.18 55.15,61.69 55.88,60.96 | IC1.4 57.55,59.29 55.88,60.96
  Top 0.406: 81.28,4.19 81.28,2.54 | 66.29,59.69 65.02,59.69 | 63.5,60.96 64.77,60.96 65.02,60.71
  Top 0.508: 81.03,27.94 82.55,27.94
  Top 0.61: 65.02,60.69 65.02,59.69 65.02,52.32 v64.77,52.07
  Top 0.762: 80.01,31.75 78.1,31.75 IC2.2 77.79,32.07 72.39,32.07
  Top 1.016: v64.77,52.07 66.04,50.8 72.39,50.8 72.39,32.07 | 44.45,2.54 76.2,2.54 | 76.2,2.54 81.28,2.54 100.33,2.54 100.33,17.78 100.33,26.73 82.61,26.73 | DD1.P$1 76.2,7.62 76.2,2.54 | 82.55,26.67 82.55,27.94 82.55,31.75 78.1,31.75
  Bottom 0.508: 47.37,59.69 45.72,59.69 44.7,59.69
  Bottom 0.61: 67.69,48.26 64.77,48.26 v64.77,52.07 | 48.13,10.03 47.12,11.05
  Bottom 0.762: 74.93,6.35 C5.2 DD1.P$1 74.93,11.3 72.64,13.59 | 82.36,19.56 R24.2 | 36.51,67.63 SV1.2 37.15,67.31 44.77,59.69 | 44.77,59.69 50.8,53.66 54.93,53.66 56.9,51.69 64.39,51.69 v64.77,52.07 | 44.77,59.69 45.72,59.69
  Bottom 1.016: 82.36,19.56 72.64,19.56 | 72.64,19.56 72.64,13.59 | 47.12,11.05 47.12,19.56 72.64,19.56
VCC2
  Bottom 0.762: R24.1 87.31,19.05 88.58,20.32 JP2.5 88.9,20.64 91.12,22.86 C13.2
XTAL1  (1 unrouted)
  Top 0.356: 60.45,65.53 57.31,62.39 58.1,61.6 58.74,61.6 IC1.7
  Top 0.406: 60.45,65.53 60.45,72.77 62.04,74.36 68.45,74.36 68.96,73.85 68.96,73.15 68.83,73.15 | 67.94,73.15 68.83,73.15 | 68.83,73.15 69.09,72.9 69.09,69.85 X1.2
XTAL2
  Top 0.356: 62.87,70.17 62.55,69.85 X1.1 62.23,69.85 | 62.87,73.15 C2.2
  Top 0.406: 62.87,70.17 62.87,73.15 | IC1.8 59.38,62.49 62.23,65.34 62.23,69.85
(copper drawn outside any net)
  shapes: Bottom area x1, Top area x3